# Altium schematic sheet Buzzer.SchDoc
size A
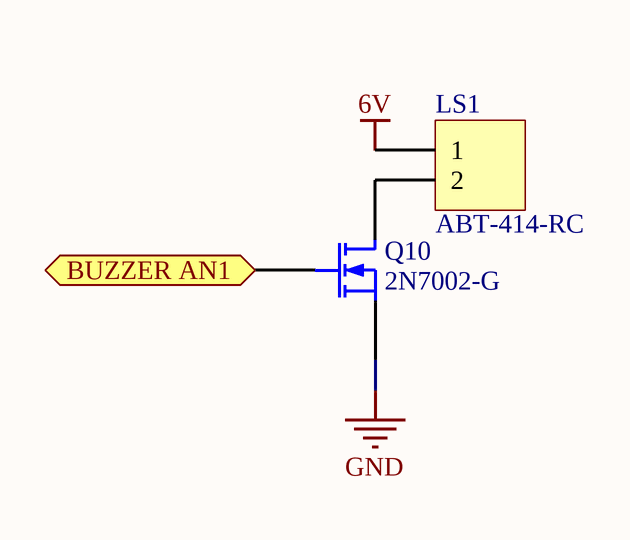
[diagram p0: Buzzer.SchDoc]

## Parts
LS1  ABT-414-RC  [Buzzer]
Q10  2N7002-G  [Mosfet]

## Ports
BUZZER AN1

## Nets
6V: LS1.1
GND: Q10.2(S)
BUZZER AN1: Q10.1(G) ; port BUZZER AN1
NetLS1_2: LS1.2 Q10.3(D)

## Library data of the parts
LS1 = Header 2: Header, 2-Pin; LatestRevisionDate: 17-Jul-2002; LatestRevisionNote: Re-released for DXP Platform.; Publisher: Altium Limited
Q10 = MOSFET-N: N-Channel MOSFET; Published: 8-Jun-2000; LatestRevisionDate: 17-Jul-2002; LatestRevisionNote: Re-released for DXP Platform.; PackageVersion: 1995/1996; PackageReference: E3; Publisher: Altium Limited; PackageDescription: TO, Flat Index; 3 In-Line, Axial Leads; Body Dia. 4.6mm; Lead Dia. 0.5 mm (max); Farnell Reference: 2775064